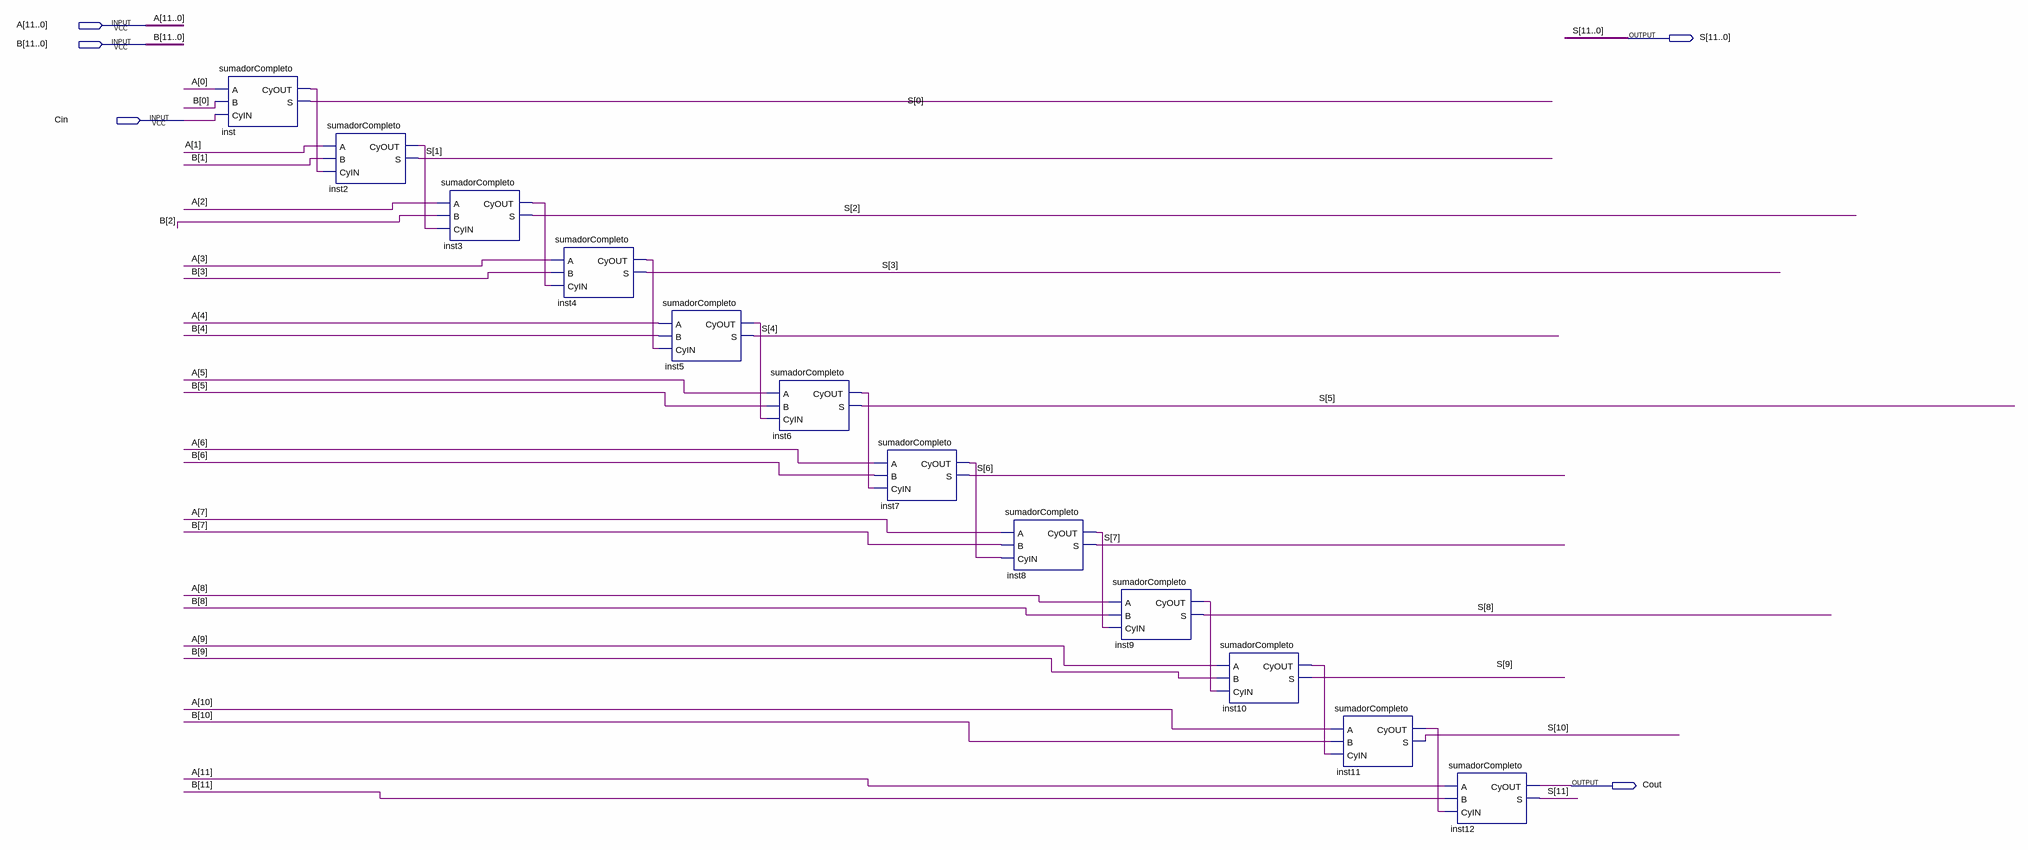
[diagram p0: schematic sheet]
// Quartus schematic sumador12Bits.bdf as structural Verilog: 12 symbols, 5 pins
module sumador12Bits (
  input  [11:0] A,
  input  [11:0] B,
  input  Cin,
  output [11:0] S,
  output Cout
);

  wire inst2_cyout, inst3_cyout, inst4_cyout, inst5_cyout, inst6_cyout, inst7_cyout, inst8_cyout,
       inst9_cyout, inst10_cyout, inst11_cyout, inst_cyout;

  sumadorCompleto inst (.A(A[0]), .B(B[0]), .CyIN(Cin), .CyOUT(inst_cyout), .S(S[0]));
  sumadorCompleto inst2 (.A(A[1]), .B(B[1]), .CyIN(inst_cyout), .CyOUT(inst2_cyout), .S(S[1]));
  sumadorCompleto inst3 (.A(A[2]), .B(B[2]), .CyIN(inst2_cyout), .CyOUT(inst3_cyout), .S(S[2]));
  sumadorCompleto inst4 (.A(A[3]), .B(B[3]), .CyIN(inst3_cyout), .CyOUT(inst4_cyout), .S(S[3]));
  sumadorCompleto inst5 (.A(A[4]), .B(B[4]), .CyIN(inst4_cyout), .CyOUT(inst5_cyout), .S(S[4]));
  sumadorCompleto inst6 (.A(A[5]), .B(B[5]), .CyIN(inst5_cyout), .CyOUT(inst6_cyout), .S(S[5]));
  sumadorCompleto inst7 (.A(A[6]), .B(B[6]), .CyIN(inst6_cyout), .CyOUT(inst7_cyout), .S(S[6]));
  sumadorCompleto inst8 (.A(A[7]), .B(B[7]), .CyIN(inst7_cyout), .CyOUT(inst8_cyout), .S(S[7]));
  sumadorCompleto inst9 (.A(A[8]), .B(B[8]), .CyIN(inst8_cyout), .CyOUT(inst9_cyout), .S(S[8]));
  sumadorCompleto inst10 (.A(A[9]), .B(B[9]), .CyIN(inst9_cyout), .CyOUT(inst10_cyout), .S(S[9]));
  sumadorCompleto inst11 (.A(A[10]), .B(B[10]), .CyIN(inst10_cyout), .CyOUT(inst11_cyout), .S(S[10]));
  sumadorCompleto inst12 (.A(A[11]), .B(B[11]), .CyIN(inst11_cyout), .CyOUT(Cout), .S(S[11]));
endmodule
